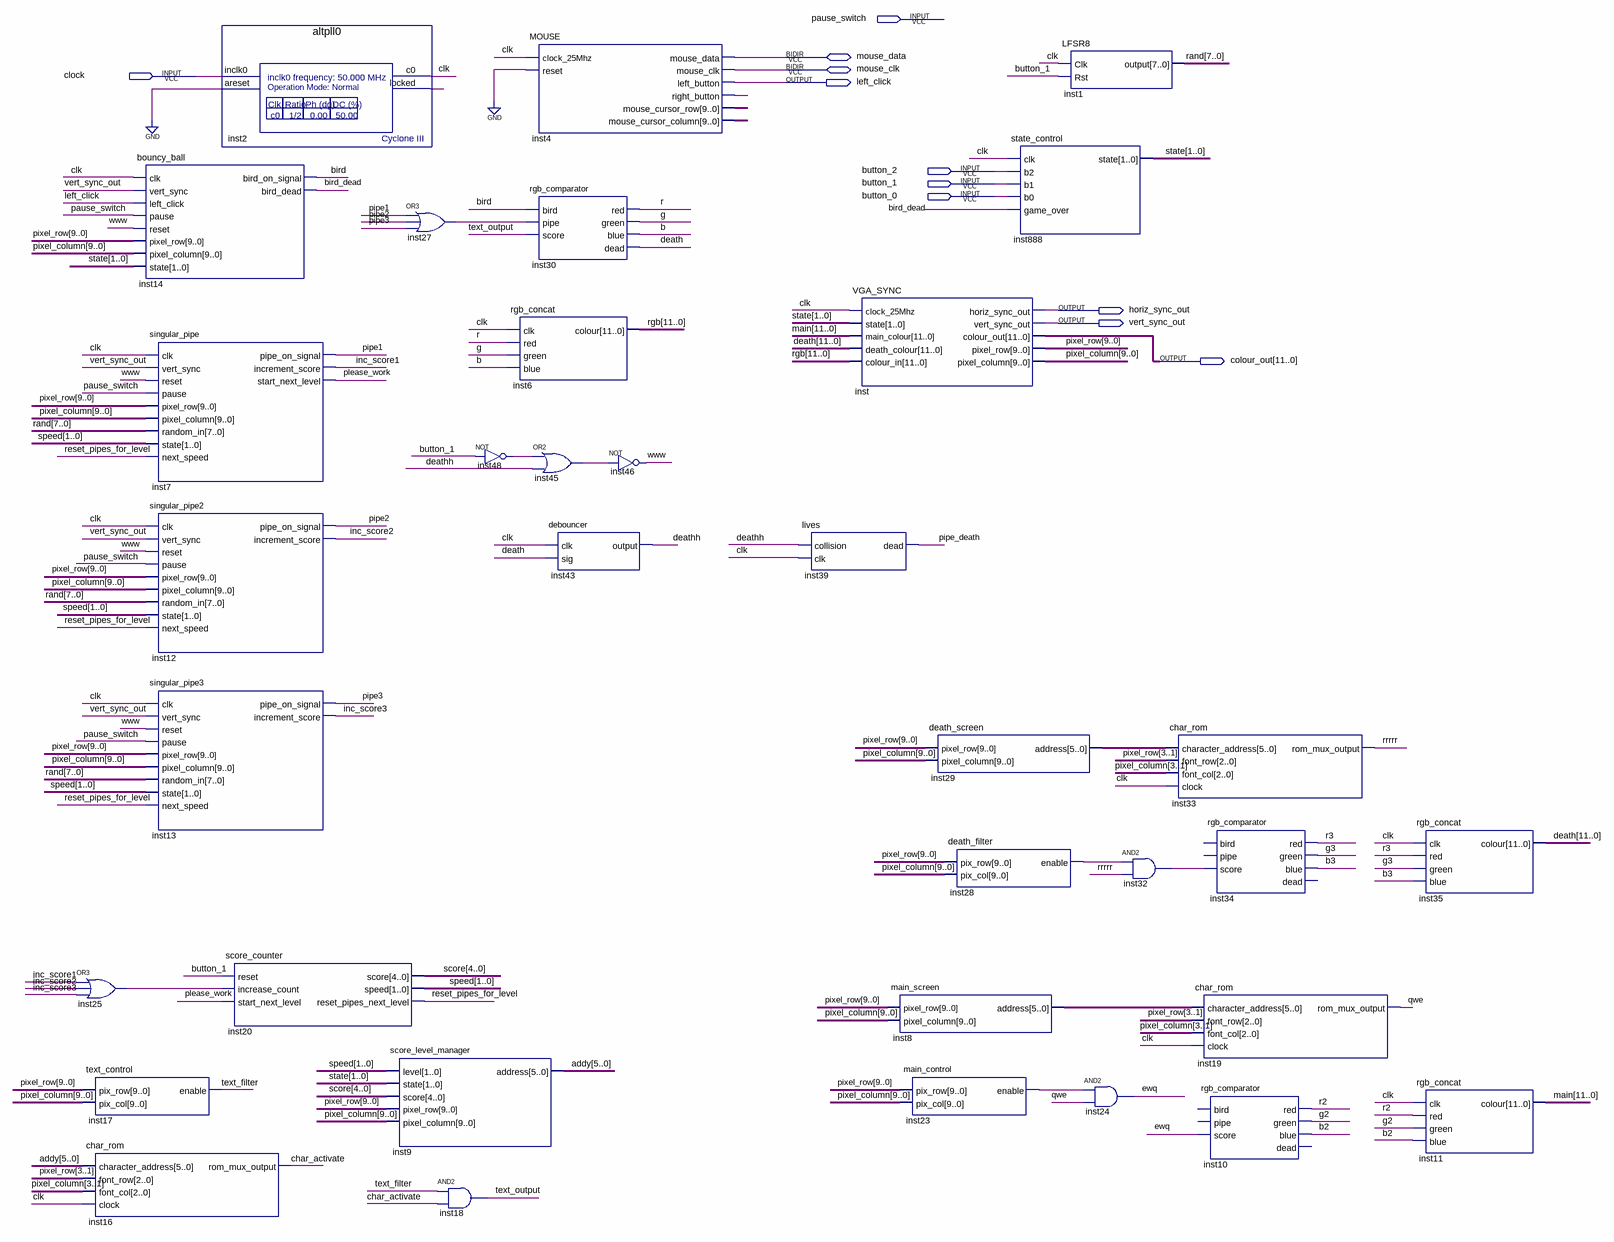
[diagram p0: schematic sheet]
// Quartus schematic flappybird.bdf as structural Verilog: 35 symbols, 11 pins
module flappybird (
  input  pause_switch,
  input  clock,
  input  button_2,
  input  button_1,
  input  button_0,
  inout  mouse_data,
  inout  mouse_clk,
  output left_click,
  output horiz_sync_out,
  output vert_sync_out,
  output [11:0] colour_out
);

  wire b, b2, b3, bird, bird_dead, char_activate, clk, death_1bit, deathh, ewq, g, g2, g3, inc_score1,
       inc_score2, inc_score3, inst2_locked, inst4_right_button, inst23_enable, inst25_out, inst27_out,
       inst28_enable, inst32_out, inst45_out, inst48_out, pipe1, pipe2, pipe3, pipe_death, please_work, qwe,
       r, r2, r3, reset_pipes_for_level, rrrrr, text_filter, text_output, www;
  wire [1:0] speed, state;
  wire [4:0] score;
  wire [5:0] addy, inst8_address, inst29_address;
  wire [7:0] \rand ;
  wire [9:0] inst4_mouse_cursor_column, inst4_mouse_cursor_row, pixel_column, pixel_row;
  wire [11:0] death, main, rgb;

  or inst25 (inst25_out, inc_score1, inc_score2, inc_score3);
  text_control inst17 (.pix_row(pixel_row), .pix_col(pixel_column), .enable(text_filter));
  char_rom inst16 (
    .character_address(addy), .font_row(pixel_row[3:1]), .font_col(pixel_column[3:1]), .clock(clk),
    .rom_mux_output(char_activate));
  bouncy_ball inst14 (
    .clk(clk), .vert_sync(vert_sync_out), .left_click(left_click), .pause(pause_switch), .reset(www),
    .pixel_row(pixel_row), .pixel_column(pixel_column), .state(state), .bird_on_signal(bird),
    .bird_dead(bird_dead));
  singular_pipe inst7 (
    .clk(clk), .vert_sync(vert_sync_out), .reset(www), .pause(pause_switch), .pixel_row(pixel_row),
    .pixel_column(pixel_column), .random_in(\rand ), .state(speed), .next_speed(reset_pipes_for_level),
    .pipe_on_signal(pipe1), .increment_score(inc_score1), .start_next_level(please_work));
  singular_pipe2 inst12 (
    .clk(clk), .vert_sync(vert_sync_out), .reset(www), .pause(pause_switch), .pixel_row(pixel_row),
    .pixel_column(pixel_column), .random_in(\rand ), .state(speed), .next_speed(reset_pipes_for_level),
    .pipe_on_signal(pipe2), .increment_score(inc_score2));
  singular_pipe3 inst13 (
    .clk(clk), .vert_sync(vert_sync_out), .reset(www), .pause(pause_switch), .pixel_row(pixel_row),
    .pixel_column(pixel_column), .random_in(\rand ), .state(speed), .next_speed(reset_pipes_for_level),
    .pipe_on_signal(pipe3), .increment_score(inc_score3));
  altpll0 inst2 (.inclk0(clock), .areset(1'b0), .c0(clk), .locked(inst2_locked));
  score_counter inst20 (
    .reset(button_1), .increase_count(inst25_out), .start_next_level(please_work), .score(score),
    .speed(speed), .reset_pipes_next_level(reset_pipes_for_level));
  score_level_manager inst9 (
    .level(speed), .state(state), .score(score), .pixel_row(pixel_row), .pixel_column(pixel_column),
    .address(addy));
  or inst27 (inst27_out, pipe1, pipe2, pipe3);
  and inst18 (text_output, text_filter, char_activate);
  not inst48 (inst48_out, button_1);
  MOUSE inst4 (
    .clock_25Mhz(clk), .reset(1'b0), .left_button(left_click), .right_button(inst4_right_button),
    .mouse_cursor_row(inst4_mouse_cursor_row), .mouse_cursor_column(inst4_mouse_cursor_column),
    .mouse_data(mouse_data), .mouse_clk(mouse_clk));
  rgb_comparator inst30 (
    .bird(bird), .pipe(inst27_out), .score(text_output), .red(r), .green(g), .blue(b), .dead(death_1bit));
  rgb_concat inst6 (.clk(clk), .red(r), .green(g), .blue(b), .colour(rgb));
  or inst45 (inst45_out, inst48_out, deathh);
  debouncer inst43 (.clk(clk), .sig(death_1bit), .\output (deathh));
  not inst46 (www, inst45_out);
  lives inst39 (.collision(deathh), .clk(clk), .dead(pipe_death));
  VGA_SYNC inst (
    .clock_25Mhz(clk), .state(state), .main_colour(main), .death_colour(death), .colour_in(rgb),
    .horiz_sync_out(horiz_sync_out), .vert_sync_out(vert_sync_out), .colour_out(colour_out),
    .pixel_row(pixel_row), .pixel_column(pixel_column));
  main_screen inst8 (.pixel_row(pixel_row), .pixel_column(pixel_column), .address(inst8_address));
  death_screen inst29 (.pixel_row(pixel_row), .pixel_column(pixel_column), .address(inst29_address));
  death_filter inst28 (.pix_row(pixel_row), .pix_col(pixel_column), .enable(inst28_enable));
  main_control inst23 (.pix_row(pixel_row), .pix_col(pixel_column), .enable(inst23_enable));
  state_control inst888 (.clk(clk), .b2(button_2), .b1(button_1), .b0(button_0), .game_over(bird_dead), .state(state));
  LFSR8 inst1 (.Clk(clk), .Rst(button_1), .\output (\rand ));
  and inst24 (ewq, inst23_enable, qwe);
  and inst32 (inst32_out, inst28_enable, rrrrr);
  char_rom inst33 (
    .character_address(inst29_address), .font_row(pixel_row[3:1]), .font_col(pixel_column[3:1]), .clock(clk),
    .rom_mux_output(rrrrr));
  char_rom inst19 (
    .character_address(inst8_address), .font_row(pixel_row[3:1]), .font_col(pixel_column[3:1]), .clock(clk),
    .rom_mux_output(qwe));
  rgb_comparator inst10 (.score(ewq), .red(r2), .green(g2), .blue(b2));  // open: bird, pipe, dead
  rgb_comparator inst34 (.score(inst32_out), .red(r3), .green(g3), .blue(b3));  // open: bird, pipe, dead
  rgb_concat inst35 (.clk(clk), .red(r3), .green(g3), .blue(b3), .colour(death));
  rgb_concat inst11 (.clk(clk), .red(r2), .green(g2), .blue(b2), .colour(main));
endmodule
